# Altium schematic sheet Sheet2.SchDoc
size A4
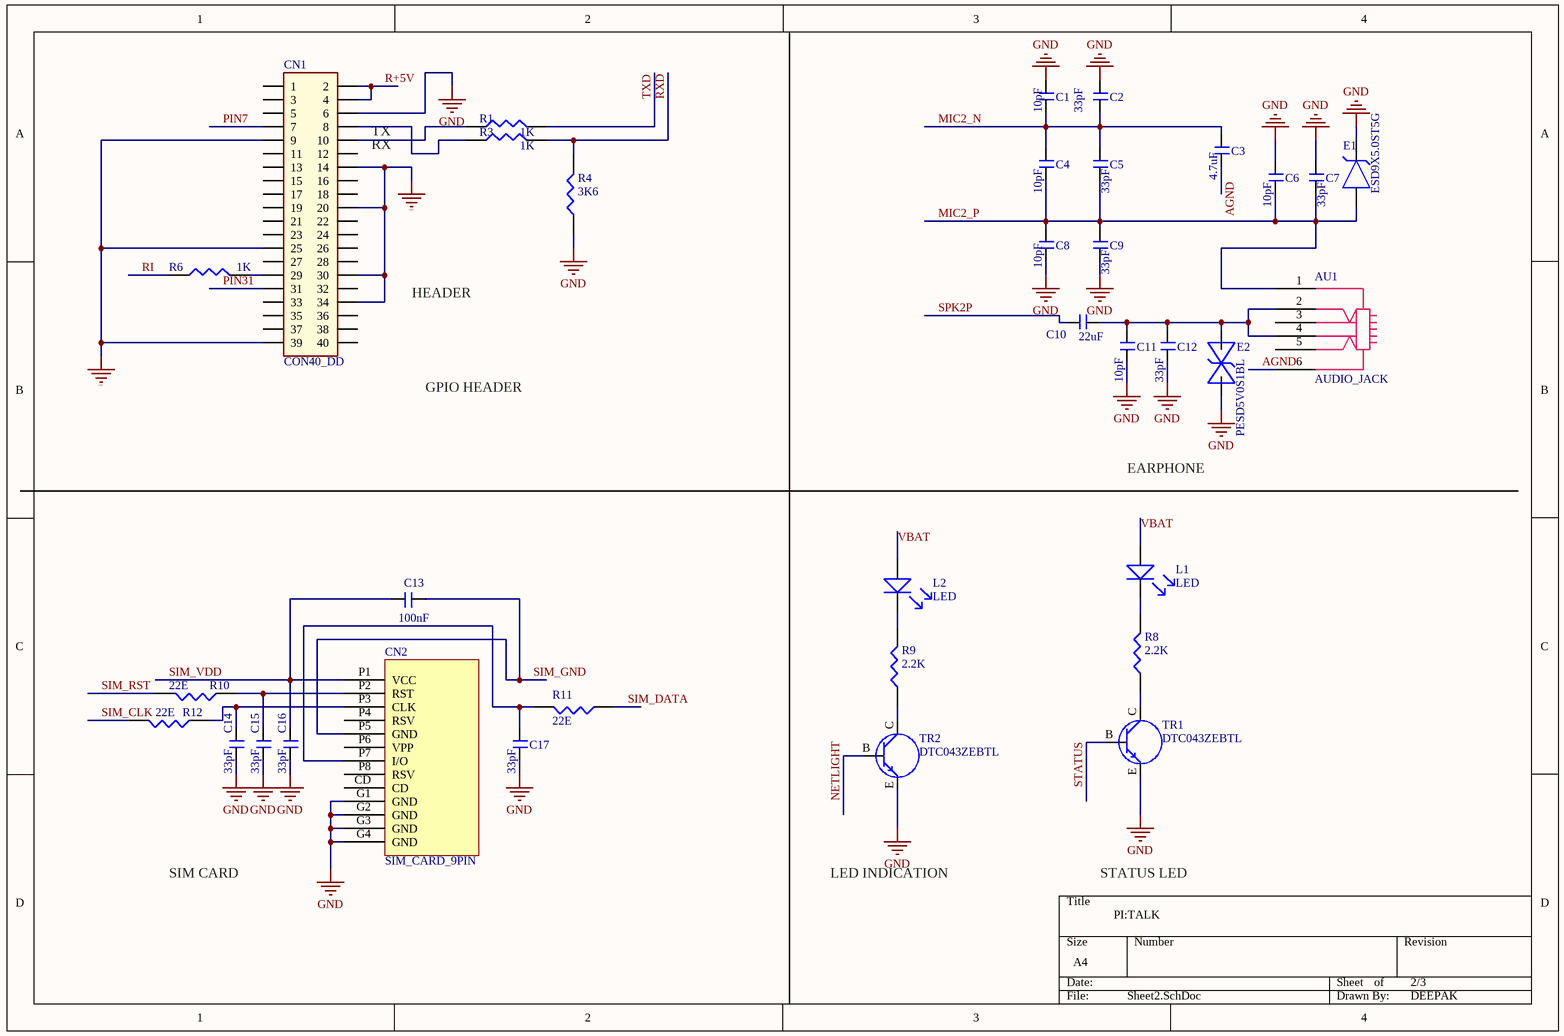
[diagram p0: Sheet2.SchDoc]

## Parts
AU1  AUDIO_JACK  [EARPHONE_JACK_4183A06]
C1  10pF  [CAP_0603_NONPOLAR]
C2  33pF  [CAP_0603_NONPOLAR]
C3  4.7uF  [0805]
C4  10pF  [CAP_0603_NONPOLAR]
C5  33pF  [CAP_0603_NONPOLAR]
C6  10pF  [CAP_0603_NONPOLAR]
C7  33pF  [CAP_0603_NONPOLAR]
C8  10pF  [CAP_0603_NONPOLAR]
C9  33pF  [CAP_0603_NONPOLAR]
C10  22uF  [CAP_0603_NONPOLAR]
C11  10pF  [CAP_0603_NONPOLAR]
C12  33pF  [CAP_0603_NONPOLAR]
C13  100nF  [CAP_0603_NONPOLAR]
C14  33pF  [CAP_0603_NONPOLAR]
C15  33pF  [CAP_0603_NONPOLAR]
C16  33pF  [CAP_0603_NONPOLAR]
C17  33pF  [CAP_0603_NONPOLAR]
CN1  CON40_DD  [CON40_DD_2p5mm]
CN2  SIM_CARD_9PIN  [SIM_CARD_9PIN - duplicate]
E1  ESD9X5.0ST5G  [SOD923]
E2  PESD5V0S1BL  [SOD882]
L1  LED  [LED_0603_neg]
L2  LED  [LED_0603_neg]
R1  1K  [0603]
R3  1K  [0603]
R4  3K6  [0603]
R6  1K  [0603]
R8  2.2K  [0603]
R9  2.2K  [0603]
R10  22E  [0603]
R11  22E  [0603]
R12  22E  [0603]
TR1  DTC043ZEBTL  [DTC043ZEBTL]
TR2  DTC043ZEBTL  [DTC043ZEBTL]

## Nets
GND: C1.2 C2.2 C6.2 C7.2 C8.1 C9.1 C11.1 C12.1 C14.1 C15.1 C16.1 C17.1 CN1.6 CN1.9 CN1.14 CN1.20 CN1.25 CN1.30 CN1.34 CN1.39 CN2.G1(GND) CN2.G2(GND) CN2.G3(GND) CN2.G4(GND) E1.1(C) E2.1(C) R4.1 TR1.E TR2.E
AGND: AU1.6(+VE) C3.1
MIC2_N: C1.1 C2.1 C3.2 C4.2 C5.2
MIC2_P: AU1.1(GND) C4.1 C5.1 C6.1 C7.1 C8.2 C9.2 E1.2(A)
NETLIGHT: TR2.B
PIN7: CN1.7
PIN31: CN1.31
R+5V: CN1.2 CN1.4
RI: R6.1
RXD: R3.2 R4.2
SIM_CLK: R12.2
SIM_DATA: R11.1
SIM_GND: C13.2 CN2.P5(GND)
SIM_RST: R10.2
SIM_VDD: C13.1 C16.2 CN2.P1(VCC)
SPK2P: C10.2
STATUS: TR1.B
TXD: R1.2
VBAT: L1.A L2.A
NetAU1_2: AU1.2(+VE) AU1.4(+VE) C10.1 C11.2 C12.2 E2.2(A)
NetC14_2: C14.2 CN2.P3(CLK) R12.1
NetC15_2: C15.2 CN2.P2(RST) R10.1
NetC17_2: C17.2 CN2.P7(I/O) R11.2
NetCN1_8: CN1.8 R3.1
NetCN1_10: CN1.10 R1.1
NetCN1_29: CN1.29 R6.2
NetL1_K: L1.K R8.2
NetL2_K: L2.K R9.2
NetR8_1: R8.1 TR1.C
NetR9_1: R9.1 TR2.C

Not connected (* = marked no-connect by the designer): AU1 3(+VE) 5(+VE); CN1 1 3 5 11 12 13 15 16 17 18 19 21 22 23 24 26 27 28 32 33 35 36 37 38 40; CN2 CD P4(RSV) P6(VPP) P8(RSV)

## Notes on the sheet
- (near CN1) TX
- (near CN1) RX
- HEADER
- GPIO HEADER
- EARPHONE
- SIM CARD
- LED INDICATION
- STATUS LED
- PI:TALK
- 2/3
- DEEPAK

## Library data of the parts
AU1 = EARPHONE_3.5
C1-C17 = CAP_NONPOLAR
R1 R3 R4 R6 R8-R12 = RES